# Altium schematic sheet Sheet2.SchDoc
size A4; SheetNumber: 2; SheetTotal: 2
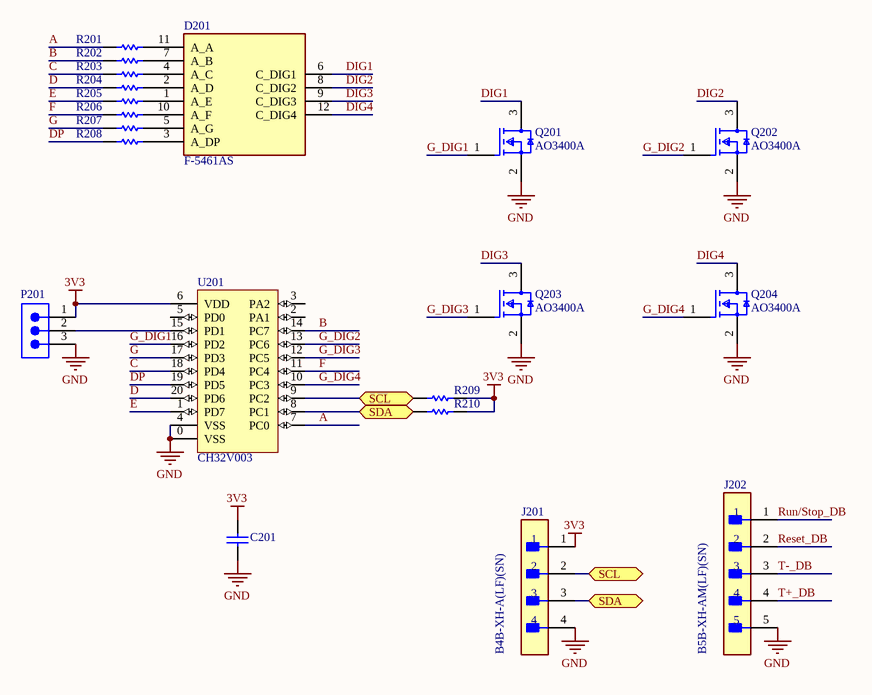
[diagram p0: Sheet2.SchDoc]

## Parts
C201  Capacitor  [CAPC1608X09N]  (value not drawn)
D201  F-5461AS  [5461AS]
J201  B4B-XH-A(LF)(SN)  [FP-B4B-XH-A_LF_SN-MFG]
J202  B5B-XH-AM(LF)(SN)  [FP-B5B-XH-AM_LF_SN-MFG]
P201  61300311121  [61300311121]  (value not drawn)
Q201  AO3400A  [FP-SOT23-MFG]
Q202  AO3400A  [FP-SOT23-MFG]
Q203  AO3400A  [FP-SOT23-MFG]
Q204  AO3400A  [FP-SOT23-MFG]
R201  Resistor  [RESC1608X06N]  (value not drawn)
R202  Resistor  [RESC1608X06N]  (value not drawn)
R203  Resistor  [RESC1608X06N]  (value not drawn)
R204  Resistor  [RESC1608X06N]  (value not drawn)
R205  Resistor  [RESC1608X06N]  (value not drawn)
R206  Resistor  [RESC1608X06N]  (value not drawn)
R207  Resistor  [RESC1608X06N]  (value not drawn)
R208  Resistor  [RESC1608X06N]  (value not drawn)
R209  Resistor  [RESC1608X06N]  (value not drawn)
R210  Resistor  [RESC1608X06N]  (value not drawn)
U201  CH32V003  [QFN40P300X300X75_HS-21N]

## Ports
SCL (bidir, see Sheet1[2B], Sheet1[3A], Sheet2[2C]), SCL (bidir, see Sheet1[2B], Sheet1[3A], Sheet2[3C]), SDA (bidir, see Sheet1[2B], Sheet1[3A], Sheet2[2C]), SDA (bidir, see Sheet1[2B], Sheet1[3A], Sheet2[3C])

## Nets
3V3: C201.2 J201.1 P201.1 R209.2 R210.2 U201.6(VDD)
GND: C201.1 J201.4 J202.5 P201.3 Q201.2(S) Q202.2(S) Q203.2(S) Q204.2(S) U201.0(VSS) U201.4(VSS)
A: R201.1 U201.7(PC0)
B: R202.1 U201.14(PC7)
C: R203.1 U201.18(PD4)
D: R204.1 U201.20(PD6)
DIG1: D201.6(C_DIG1) Q201.3(D)
DIG2: D201.8(C_DIG2) Q202.3(D)
DIG3: D201.9(C_DIG3) Q203.3(D)
DIG4: D201.12(C_DIG4) Q204.3(D)
DP: R208.1 U201.19(PD5)
E: R205.1 U201.1(PD7)
F: R206.1 U201.11(PC4)
G: R207.1 U201.17(PD3)
G_DIG1: Q201.1(G) U201.16(PD2)
G_DIG2: Q202.1(G) U201.13(PC6)
G_DIG3: Q203.1(G) U201.12(PC5)
G_DIG4: Q204.1(G) U201.10(PC3)
Reset_DB: J202.2
Run/Stop_DB: J202.1
SCL: J201.2 R209.1 U201.9(PC2) ; port SCL
SDA: J201.3 R210.1 U201.8(PC1) ; port SDA
T+_DB: J202.4
T-_DB: J202.3
NetD201_1: D201.1(A_E) R205.2
NetD201_2: D201.2(A_D) R204.2
NetD201_3: D201.3(A_DP) R208.2
NetD201_4: D201.4(A_C) R203.2
NetD201_5: D201.5(A_G) R207.2
NetD201_7: D201.7(A_B) R202.2
NetD201_10: D201.10(A_F) R206.2
NetD201_11: D201.11(A_A) R201.2
NetP201_2: P201.2 U201.15(PD1)

Not connected (* = marked no-connect by the designer): U201 2(PA1) 3(PA2) 5(PD0)

## Library data of the parts
C201 = C0603: Value: 1p; Voltage: *; Dielectric: *
D201 = 5461AS: Quad LED 7-Segment Display; Manufacturer_Name: ARK; Geometry.Height: 8.25mm; Manufacturer_Part_Number: F-5461AS; Mouser Part Number: *; Mouser Price/Stock: *; Arrow Part Number: *; Arrow Price/Stock: *; Datasheet Link: https://4donline.ihs.com/images/VipMasterIC/IC/ZOTD/ZOTDS00015/ZOTDS00015-1.pdf?hkey=EF798316E3902B6ED9A73243A3159BB0
J201 = CMP-17439-000250-1: CONN HEADER VERT 4POS 2.5MM; Number of Contacts: 4; Contact Resistance: 20mR; Voltage Rating: 250V; Max Current Rating: 3A; Gender: Male; Wire/Cable Gauge: 22AWG; Mated Stacking Heights: 9.8mm; Insulation Resistance: 1GR; Orientation: Straight; Contact Type: Male Pin; Contact Finish - Mating: TIN; Series: XH; Max Voltage Rating (AC): 250V; Lead Pitch: 2.5mm; Contact Shape: Square; Insulation Color: Natural; Termination: Solder; Lead Free: Lead Free; Voltage Rating (AC): 250V; Number of Rows: 1; Flammability Rating: UL94 V-0; Number of Positions: 4; Max Operating Temperature: 85°C; Package Quantity: 500; Mount: Through Hole; REACH SVHC: No SVHC; Connector Type: Header; Insulation Material: Nylon; Fastening Type: Detent; Min Operating Temperature: -25°C; Housing Color: White; Packaging: Bulk; Contact Plating: Tin; Contact Material: Brass; Max Voltage Rating (DC): 250V; Housing Material: Polyamide; Color: Natural; Material: Polyamide; Pitch: 2.5mm; Depth: 5.75mm; Current Rating: 3A; Length: 12.4mm
J202 = CMP-17439-000304-1: CONN HEADER VERT 5POS 2.5MM; Mated Stacking Heights: 9.8mm; Voltage Rating: 250V; Max Current Rating: 3A; Number of Positions: 5; Contact Resistance: 20mR; Depth: 5.75mm; Connector Type: Header; Color: Green; Insulation Material: Nylon; Contact Plating: Copper; Length: 14.9mm; Fastening Type: Detent; Contact Material: Brass; Number of Rows: 1; Contact Type: Male Pin; Housing Material: Polyamide; Housing Color: White; Lead Free: Lead Free; Max Voltage Rating (AC): 250V; Mount: Through Hole; Contact Shape: Square; Min Operating Temperature: -25°C; Packaging: Bulk; Orientation: Straight; Insulation Color: Natural; Series: XH; Flammability Rating: UL94 V-0; Contact Finish - Mating: TIN; Max Operating Temperature: 85°C; Termination: Solder; Pitch: 2.5mm
P201 = CMP-1502-01062-3: NexarPartId: 32855521; Current Rating: 3A; Voltage Rating: 250V; Number of Positions: 3; Pitch: 2.54mm; Contact Resistance: 20mΩ; Connector Type: Male Pin; Gender: Male; REACH SVHC: Unknown; Packaging: Bulk; Contact Material: Copper; Min Operating Temperature: -40°C; Number of Rows: 1; Orientation: Vertical; RoHS: Compliant; Contact Plating: Gold; Max Operating Temperature: 105°C; Mount: Through Hole; Height: 8.94mm; Operating Supply Voltage: 250V; Number of Pins: 3; Contact Mating Length: 5.9944mm; Number of Contacts: 3; Color: Black; Lead Free: Lead Free; Lead Pitch: 2.54mm; Termination: Solder
Q201-Q204 = CMP-83955-000006-1: MOSFET N-CH 30V 5.7A SOT23; Input Capacitance: 630pF; Number of Elements: 1; Rds On Max: 26.5mR; Max Power Dissipation: 1.4W; Gate to Source Voltage (Vgs): 12V; Min Operating Temperature: -55°C; Lead Free: Lead Free; Number of Pins: 3; Drain to Source Voltage (Vdss): 30V; Case/Package: SOT-23; Mount: Surface Mount; Continuous Drain Current (ID): 5.7A; Radiation Hardening: No; Packaging: Tape and Reel; Max Operating Temperature: 150°C; Power Dissipation: 1.4W
R201-R210 = R0603: Value: *
U201 = CH32V003F4U6: CH32V003 series is an industrial-grade general-purpose microcontroller designed based on QingKe RISC-V2A / core, which supports 48MHz system main frequency in the product function